# Altium schematic sheet Sheet1.SchDoc
size 420 x 297 mm; SheetNumber: 1; SheetTotal: 1
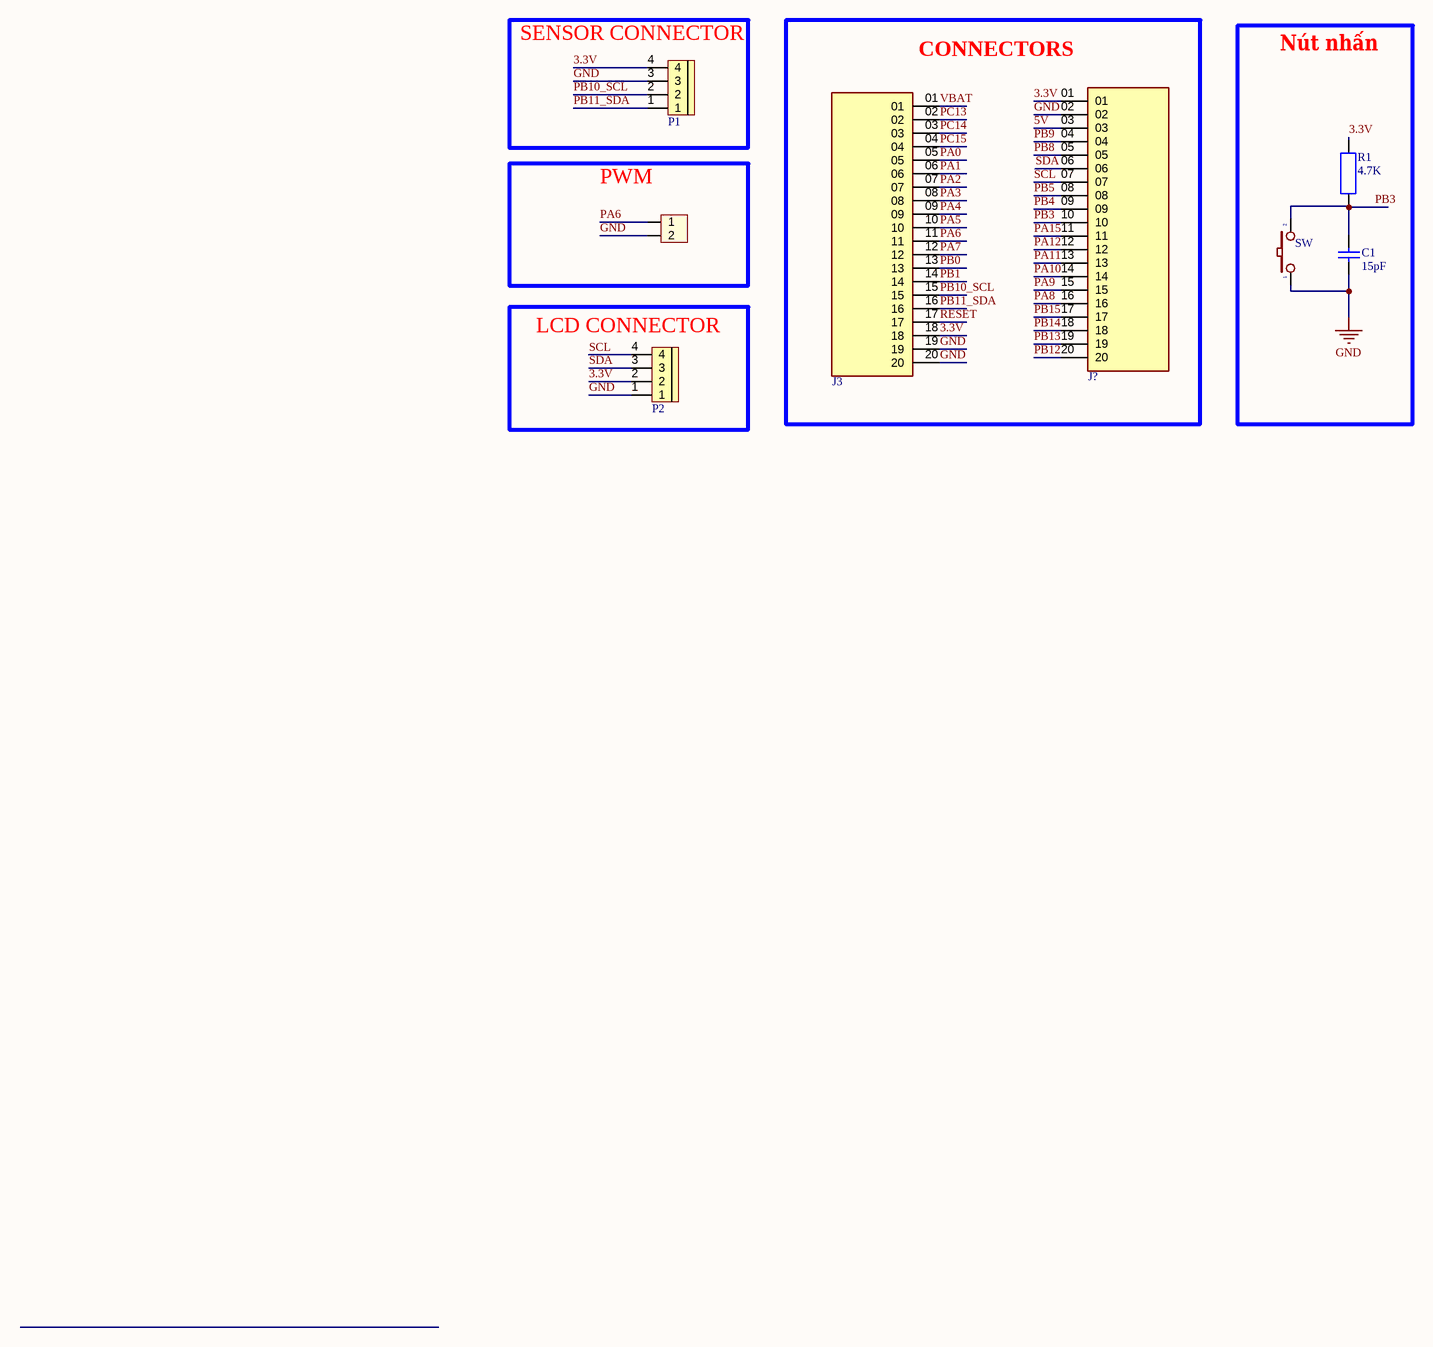
[diagram p0: Sheet1.SchDoc]

## Parts
C1  15pF  [tu gom]
H?  Header 2P 2.54mm  [Header 2P DC 2.54]  (value not drawn)
J3  ESQ-120-13-G-S  [SAMTEC_ESQ-120-13-G-S]  (value not drawn)
J?  ESQ-120-13-G-S  [SAMTEC_ESQ-120-13-G-S]  (value not drawn)
P1  CON 4 EDG5.08  [CON 4 4EDG5.08]  (value not drawn)
P2  CON 4 EDG5.08  [CON 4 4EDG5.08]  (value not drawn)
R1  4.7K  [R1W]
SW?  SW  [SW2]

## Blocks framed on the sheet
SENSOR CONNECTOR: P1
CONNECTORS: J3 J?
Nút nhấn: C1 R1 SW?
PWM: H?
LCD CONNECTOR: P2

## Nets
GND: C1.2 H?.2 J3.19 J3.20 J?.02 P1.3 P2.1 SW?.1
3.3V: J3.18 J?.01 P1.4 P2.2 R1.2
5V: J?.03
PA0: J3.05
PA1: J3.06
PA2: J3.07
PA3: J3.08
PA4: J3.09
PA5: J3.10
PA6: H?.1 J3.11
PA7: J3.12
PA8: J?.16
PA9: J?.15
PA10: J?.14
PA11: J?.13
PA12: J?.12
PA15: J?.11
PB0: J3.13
PB1: J3.14
PB3: C1.1 J?.10 R1.1 SW?.2
PB4: J?.09
PB5: J?.08
PB8: J?.05
PB9: J?.04
PB10_SCL: J3.15 P1.2
PB11_SDA: J3.16 P1.1
PB12: J?.20
PB13: J?.19
PB14: J?.18
PB15: J?.17
PC13: J3.02
PC14: J3.03
PC15: J3.04
RESET: J3.17
SCL: J?.07 P2.4
SDA: J?.06 P2.3
VBAT: J3.01

## Notes on the sheet
- THIS DOCUMENT AND THE DATA DISCLOSED HEREIN OR
- HEREWITH IS THE PROPERTY OF ALTIUM LIMITED AND MAY
- DWG NO:
- REVISION
- REV:
- DESCRIPTION
- DATE
- APPROVED
- BE FREELY DISTRIBUTED IN WHOLE. NO RIGHTS ARE
- RESERVED OR EXPRESS OR IMPLIED WARANTEE GIVEN.
- ENG:
- APPROVALS
- PROJECT
- DSN:
- CHK:
- REFERENCE DOCUMENTS
- PROJECT REVISION:
- TITLE
- DOCUMENT REVISION:
- DESIGN ITEM:
- BOM:
- FAB DWG:
- PCB DWG:
- ASSY DWG:
- SCALE:
- A3
- SIZE
- CAGE CODE
- FILE NAME
- DWG NO.
- SHEET
- OF
- REV

## Library data of the parts
C1 = Tu gom 15pF 50V: Cắm; Don_Vi: Con; So_Chan: 2; Ten_Linh_Kien: Tụ gốm 15P 50V; Ma_Hang: MH004767; Chung_Loai: Cắm; Kieu_Chan: *
H? = Header 2P 2.54 Duc Cong: Cắm; Ten_Linh_Kien: Header 2P XH2.54-2P Đực Cong; Don_Vi: Con; Ma_Hang: MH002852; Chung_Loai: Cắm
P1 P2 = CON 4 EDG5.08: Cắm; Ten_Linh_Kien: CON 4 2EDG5.08-4P 5.08MM ( Xanh Cong); Ma_Hang: MH000979; Don_Vi: Con; Ghi_Chu: *; Kieu_Chan: *; Chung_Loai: Cắm
R1 = R1W: Resistor 1W; Value: R1W - 100
SW? = SW2: Switch button 2 pin; Value: SW chip 2 pin
J3 J? = ESQ-120-13-G-S: Price: None; MP: ESQ-120-13-G-S; Availability: Unavailable; Package: None; Value: *